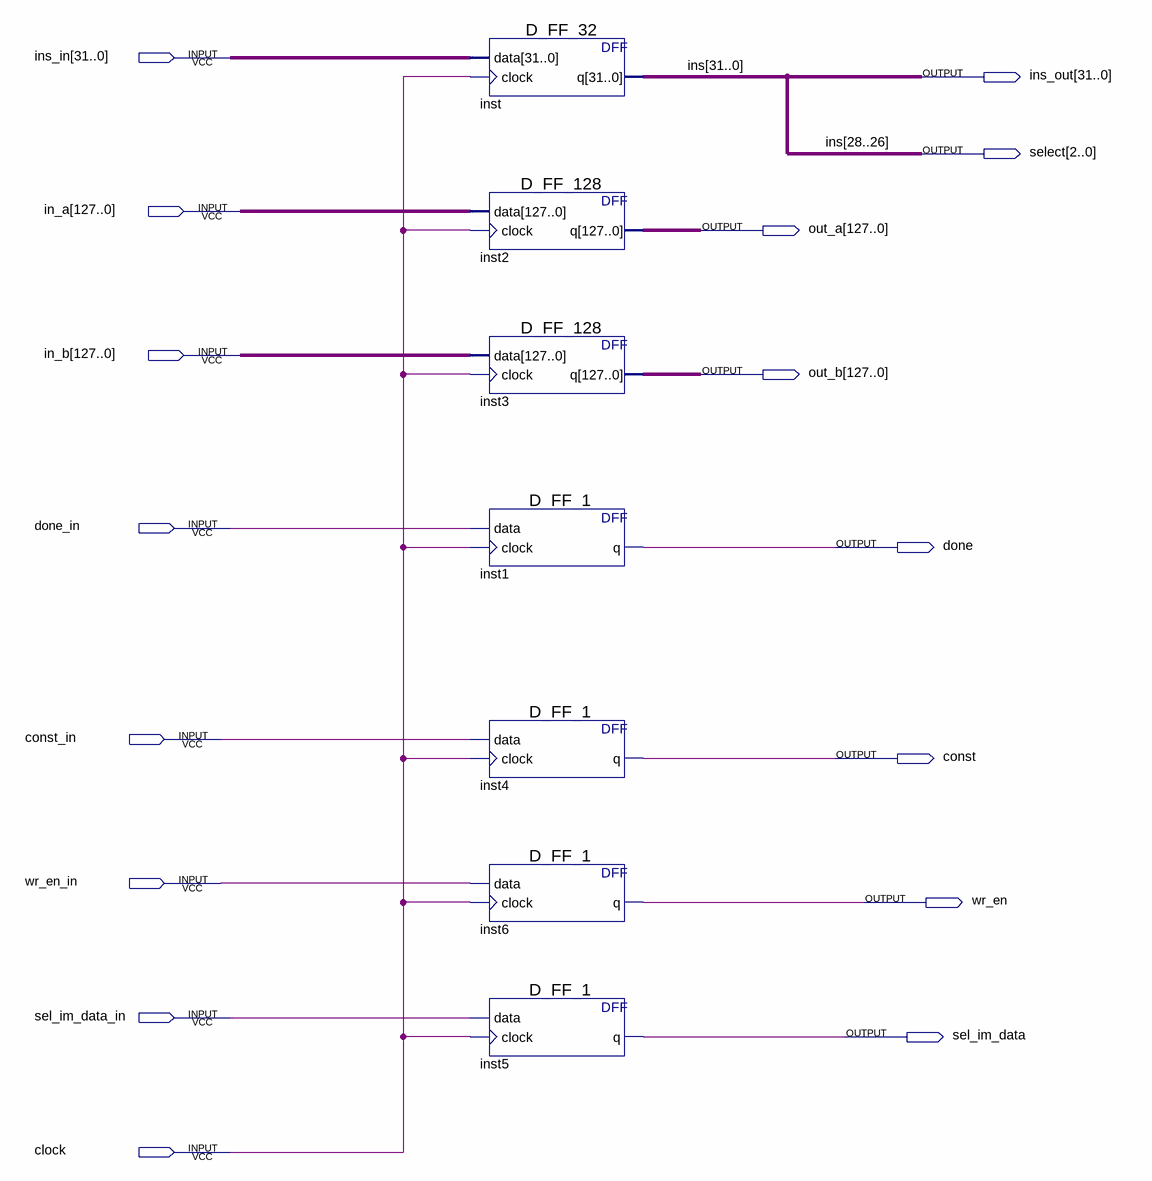
[diagram p0: schematic sheet]
// Quartus schematic CO_ID_EX.bdf as structural Verilog: 7 symbols, 16 pins
module CO_ID_EX (
  input  [31:0] ins_in,
  input  [127:0] in_a,
  input  [127:0] in_b,
  input  done_in,
  input  const_in,
  input  wr_en_in,
  input  sel_im_data_in,
  input  clock,
  output [31:0] ins_out,
  output [2:0] select,
  output [127:0] out_a,
  output [127:0] out_b,
  output done,
  output \const ,
  output wr_en,
  output sel_im_data
);

  D_FF_32 inst (.data(ins_in), .clock(clock), .q(ins_out));
  D_FF_128 inst2 (.data(in_a), .clock(clock), .q(out_a));
  D_FF_128 inst3 (.data(in_b), .clock(clock), .q(out_b));
  D_FF_1 inst1 (.data(done_in), .clock(clock), .q(done));
  D_FF_1 inst4 (.data(const_in), .clock(clock), .q(\const ));
  D_FF_1 inst6 (.data(wr_en_in), .clock(clock), .q(wr_en));
  D_FF_1 inst5 (.data(sel_im_data_in), .clock(clock), .q(sel_im_data));

  assign select = ins_out[28:26];

  // Other names for the same wires on the sheet: ins[31:0] = ins_out
endmodule
